# Altium project Bricks_signal v3.1.PrjPcb
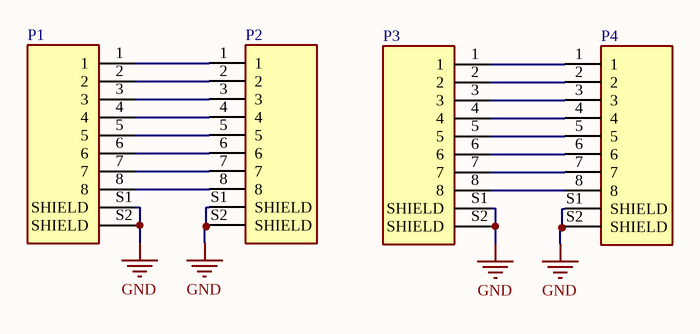
[diagram p0: sheet.SchDoc]
1 sheet, 4 parts. Net scope: global (net labels, ports and power ports of the same name join across sheets).
Board files: PCB1.PcbDoc, schematics.PcbDoc

## Sheet sheet.SchDoc
size A

### Parts
P1  1-406541-5  [TE_1-406541-5]  (value not drawn)
P2  1-406541-5  [TE_1-406541-5]  (value not drawn)
P3  1-406541-5  [TE_1-406541-5]  (value not drawn)
P4  1-406541-5  [TE_1-406541-5]  (value not drawn)

### Nets
GND: P1.S1(SHIELD) P1.S2(SHIELD) P2.S1(SHIELD) P2.S2(SHIELD) P3.S1(SHIELD) P3.S2(SHIELD) P4.S1(SHIELD) P4.S2(SHIELD)
NetP1_1: P1.1 P2.1
NetP1_2: P1.2 P2.2
NetP1_3: P1.3 P2.3
NetP1_4: P1.4 P2.4
NetP1_5: P1.5 P2.5
NetP1_6: P1.6 P2.6
NetP1_7: P1.7 P2.7
NetP1_8: P1.8 P2.8
NetP3_1: P3.1 P4.1
NetP3_2: P3.2 P4.2
NetP3_3: P3.3 P4.3
NetP3_4: P3.4 P4.4
NetP3_5: P3.5 P4.5
NetP3_6: P3.6 P4.6
NetP3_7: P3.7 P4.7
NetP3_8: P3.8 P4.8

### Library data of the parts
P1-P4 = 1-406541-5: Conn RJ-45 F 8 POS 2.04mm Solder RA Thru-Hole 8 Terminal 1 Port Cat 5 Box/Tray; MF: {'manufacturer': u'TE Connectivity'}; Package: None; Price: None; Value: *; MP: 1-406541-5; Availability: Unavailable